# EasyEDA Pro project ProProject_飞镖发射架调试用控制板_2024-03-21.epro

# Schematic Schematic1
Create Date: 2024-01-27; Page Name: P1; Project Name: 飞镖发射架调试用控制板; Schematic Name: Schematic1; Update Date: 2024-03-21; Company: 嘉立创EDA; Page Size: A4; Version: V1.0
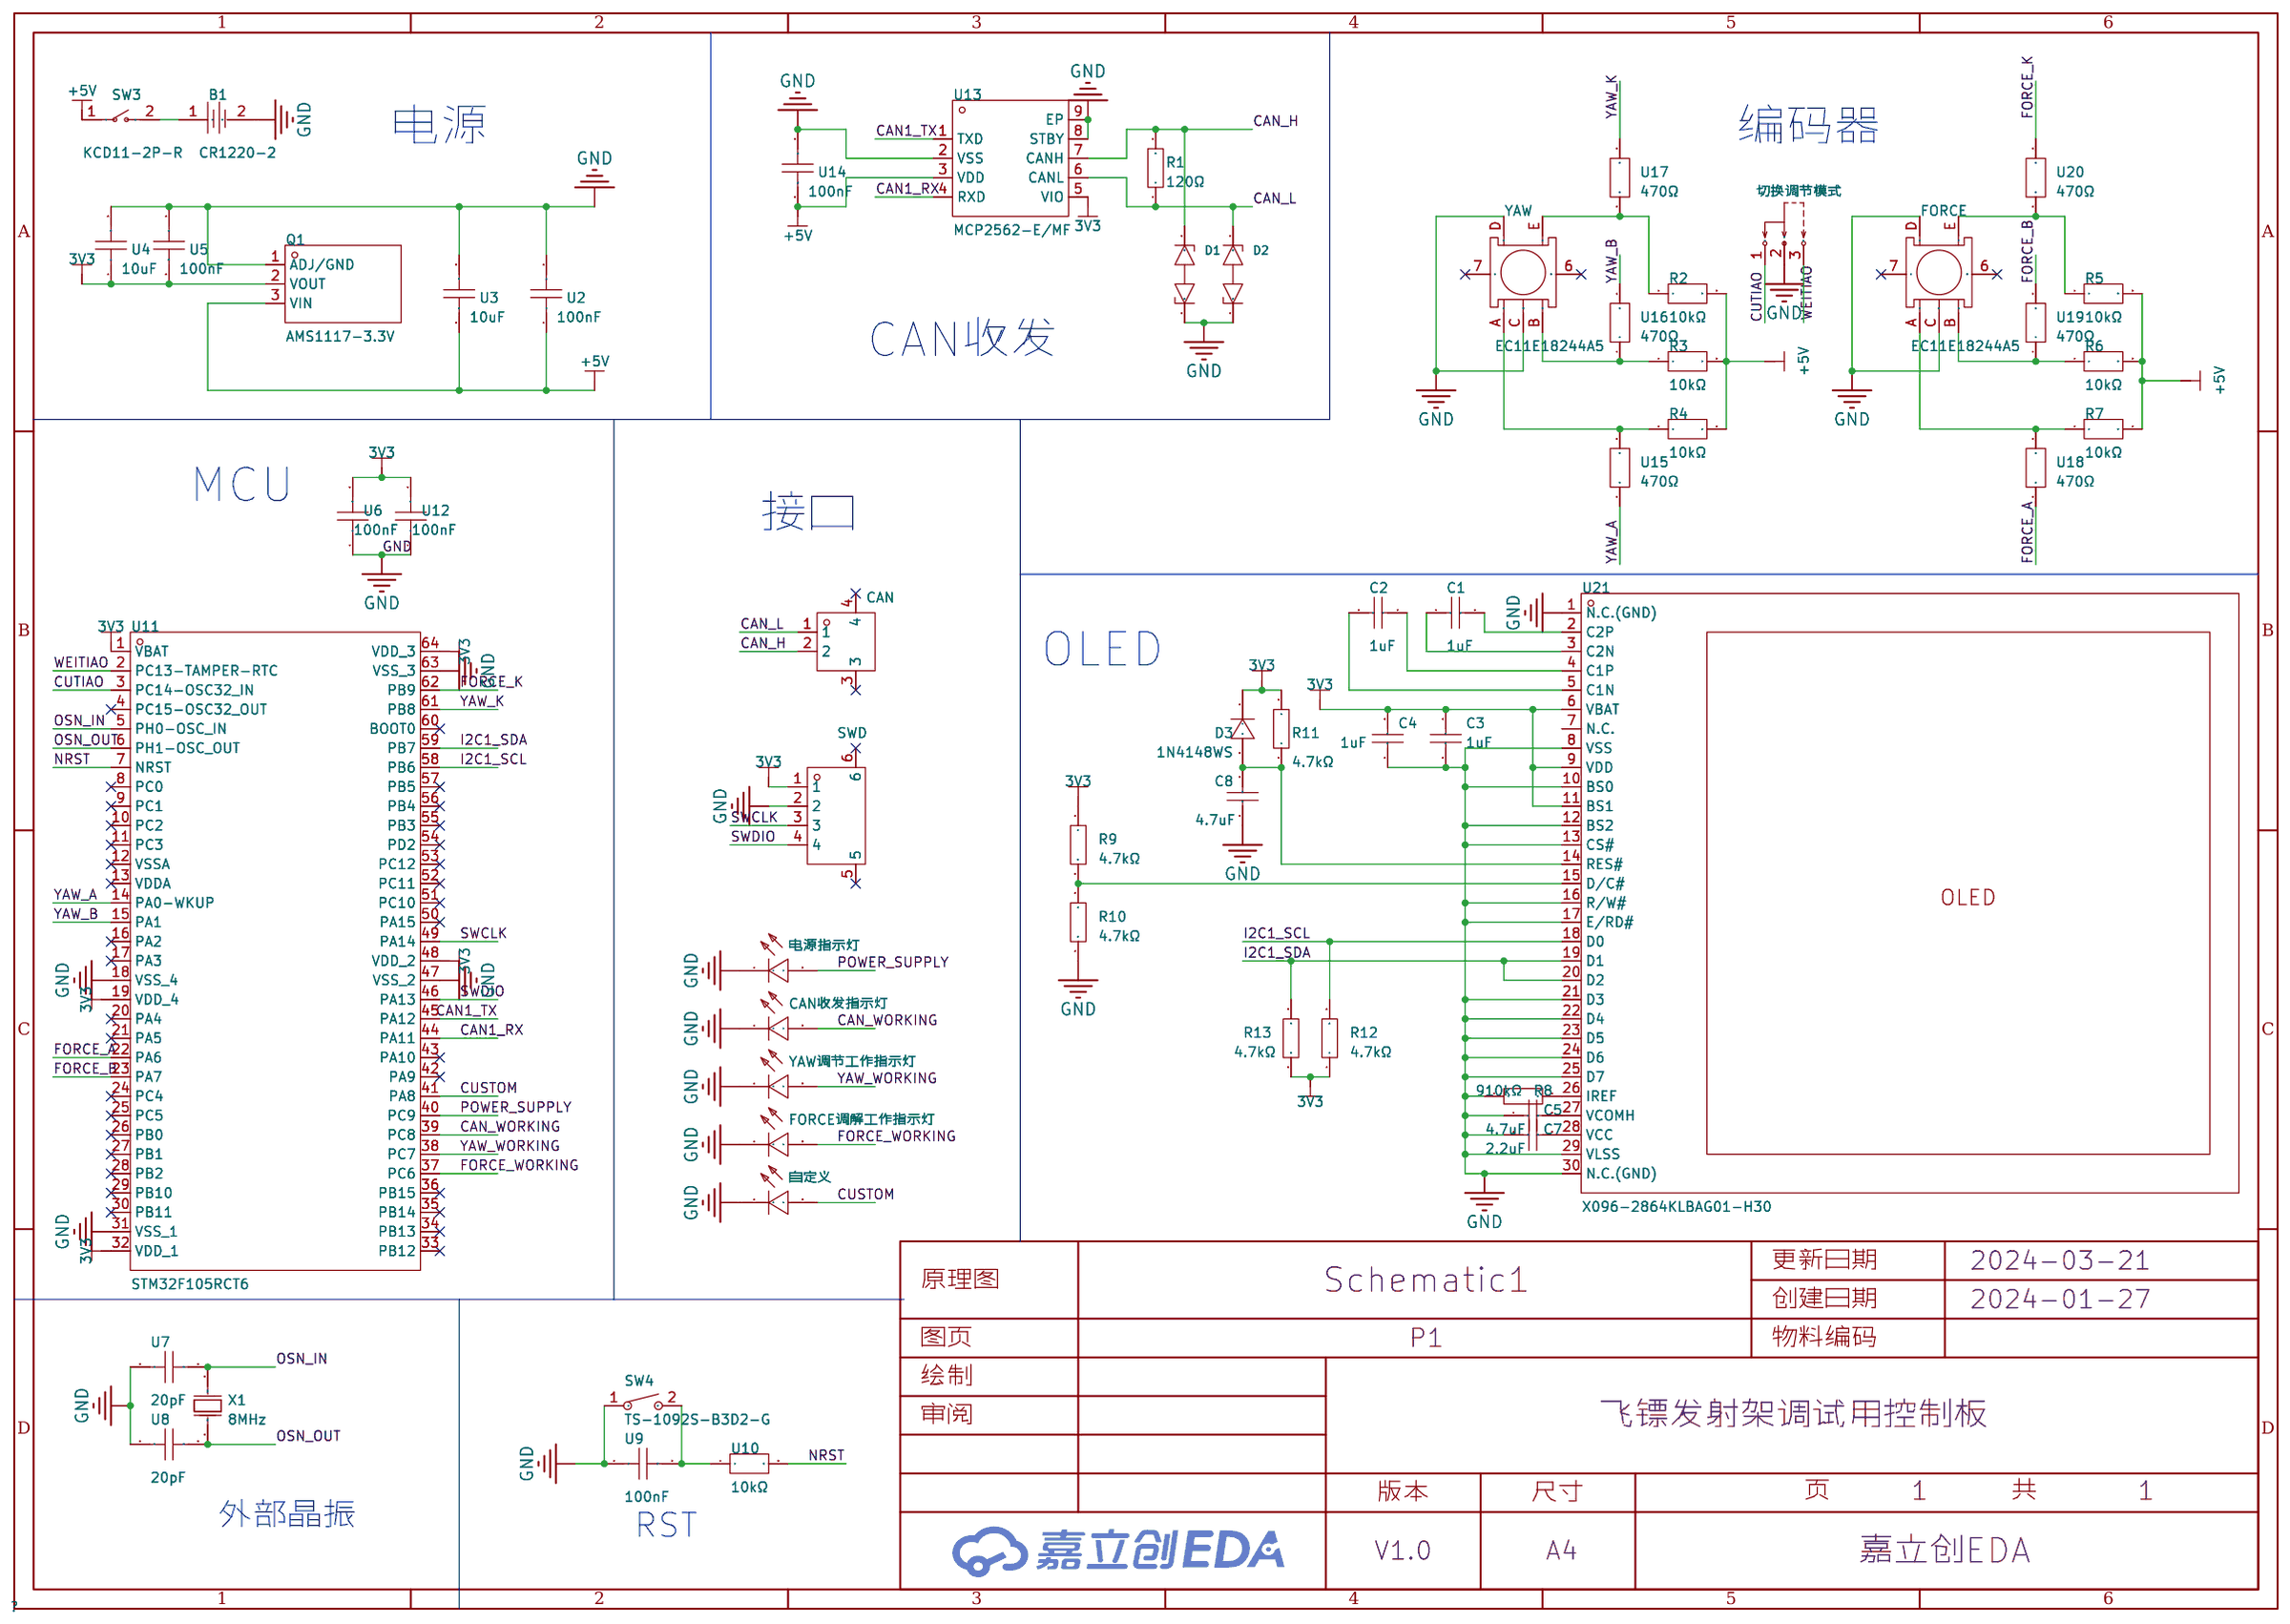
[diagram p0: schematic sheet]

## Parts
B1  CR1220-2  [BAT-SMD_CR1220-2]
C1  1uF  [C0603]
C2  1uF  [C0603]
C3  1uF  [C0603]
C4  1uF  [C0603]
C5  4.7uF  [C0603]
C7  2.2uF  [C0603]
C8  4.7uF  [C0603]
CAN  WAFER-GH1.25-2PLB  [CONN-TH_2P-P1.25_XUNPU_WAFER-GH1.25-2PLB]
CAN收发指示灯  NCD0603R1  [LED0603-RD_RED]
D1  PESD5V0S1BA,115  [SOD-323_L1.7-W1.3-LS2.5-BI]
D2  PESD5V0S1BA,115  [SOD-323_L1.7-W1.3-LS2.5-BI]
D3  1N4148WS  [SOD-323_L1.8-W1.3-LS2.5-RD]
FORCE  EC11E18244A5  [SW-TH_EC11E18244A5]
FORCE调解工作指示灯  NCD0603R1  [LED0603-RD_RED]
Q1  AMS1117-3.3V  [SOT-89-3_L4.5-W2.5-P1.50-LS4.2-BR]
R1  120Ω  [R0603]
R2  10kΩ  [R0603]
R3  10kΩ  [R0603]
R4  10kΩ  [R0603]
R5  10kΩ  [R0603]
R6  10kΩ  [R0603]
R7  10kΩ  [R0603]
R8  910kΩ  [R0603]
R9  4.7kΩ  [R0603]
R10  4.7kΩ  [R0603]
R11  4.7kΩ  [R0603]
R12  4.7kΩ  [R0603]
R13  4.7kΩ  [R0603]
SW3  KCD11-2P-R  [SW-TH_2P-L15.0-W10.5-P5.00_KCD11-2P-R]
SW4  TS-1092S-B3D2-G  [SW-SMD_L6.1-W3.6-LS7.9]
SWD  WAFER-MX1.25-4PWB  [CONN-SMD_4P-P1.25_WAFER-MX1.25-4PWB]
U2  100nF  [C0603]
U3  10uF  [C0603]
U4  10uF  [C0603]
U5  100nF  [C0603]
U6  100nF  [C0603]
U7  20pF  [C0402]
U8  20pF  [C0402]
U9  100nF  [C0603]
U10  10kΩ  [R0603]
U11  STM32F105RCT6  [LQFP-64_L10.0-W10.0-P0.50-LS12.0-BL]
U12  100nF  [C0603]
U13  MCP2562-E/MF  [DFN-8_L3.0-W3.0-P0.65-BL-EP]
U14  100nF  [C0603]
U15  470Ω  [R0603]
U16  470Ω  [R0603]
U17  470Ω  [R0603]
U18  470Ω  [R0603]
U19  470Ω  [R0603]
U20  470Ω  [R0603]
U21  X096-2864KLBAG01-H30  [OLED-SMD_X096-2864KLBAG01-H30]
X1  8MHz  [CRYSTAL-SMD_L5.0-W3.2]
YAW  EC11E18244A5  [SW-TH_EC11E18244A5]
YAW调节工作指示灯  NCD0603R1  [LED0603-RD_RED]
切换调节模式  SS12D10G5  [SW-TH_SHOU-HAN_SS12D10G4]
电源指示灯  NCD0603R1  [LED0603-RD_RED]
自定义  NCD0603R1  [LED0603-RD_RED]

## Library data of the parts
B1 = CR1220-2: 连接器类型:电池底座;适用电池规格:CR1220;工作温度范围:-;; LCSC Part Name: 电池底座 适用电池:CR1220; Supplier Part: C70381; Manufacturer: Q&J; Supplier Footprint: SMD; JLCPCB Part Class: 扩展库; Datasheet: https://atta.szlcsc.com/upload/public/pdf/source/20160427/1461725216696.pdf; Supplier: LCSC; Connector Type: 电池底座; Battery Type: CR1220
C1-C4 = 0603B105K250NT: 容值:1uF;精度:±10%;额定电压:25V;材质(温度系数):X7R;; LCSC Part Name: 1uF ±10% 25V; Supplier Part: C59302; Manufacturer: FH(风华); Supplier Footprint: 0603; JLCPCB Part Class: 扩展库; Datasheet: https://atta.szlcsc.com/upload/public/pdf/source/20200305/C486355_26A10D38EF8C2A5C37091D0039909270.pdf; Supplier: LCSC; Tolerance: ±10%; Voltage Rated: 25V; Temperature Coefficient: X7R
C5 C8 = CL10A475KO8NNNC: 容值:4.7uF;精度:±10%;额定电压:16V;材质(温度系数):X5R;; LCSC Part Name: 4.7uF ±10% 16V; Supplier Part: C19666; Manufacturer: SAMSUNG(三星); Supplier Footprint: 0603; JLCPCB Part Class: 基础库; Datasheet: https://atta.szlcsc.com/upload/public/pdf/source/20160218/1457707763339.pdf; Supplier: LCSC; Tolerance: ±10%; Voltage Rated: 16V; Temperature Coefficient: X5R
C7 = CL10A225KO8NNNC: 容值:2.2uF;精度:±10%;额定电压:16V;材质(温度系数):X5R;; LCSC Part Name: 2.2uF ±10% 16V; Supplier Part: C23630; Manufacturer: SAMSUNG(三星); Supplier Footprint: 0603; JLCPCB Part Class: 基础库; Datasheet: https://atta.szlcsc.com/upload/public/pdf/source/20160218/1457707763339.pdf; Supplier: LCSC; Tolerance: ±10%; Voltage Rated: 16V; Temperature Coefficient: X5R
CAN = WAFER-GH1.25-2PLB: 插针结构:1x2P;间距:1.25mm;安装方式:立贴;参考系列:GH;总PIN数:2P;排数:1;每排PIN数:2;额定电流:1A;工作温度范围:-25℃~+85℃;; LCSC Part Name: 1x2P 间距:1.25mm 立贴 系列:GH; Supplier Part: C3029368; Manufacturer: XUNPU(讯普); Supplier Footprint: SMD,P=1.25mm; JLCPCB Part Class: 扩展库; Datasheet: https://atta.szlcsc.com/upload/public/pdf/source/20220527/44F824AAC8C2B617205E15955FF9C23D.pdf; Supplier: LCSC; Pins Structure: 1x2P; Pitch: 1.25mm; Mounting Style: 立贴; Reference Series: GH; Number of Pins: 2P; Number of Rows: 1; Number of PINs Per Row: 2; Current Rating (Max): 1A; Operating Temperature Range: -25℃~+85℃
CAN收发指示灯 FORCE调解工作指示灯 YAW调节工作指示灯 电源指示灯 自定义 = NCD0603R1_C84263: 灯头类型:-;发光颜色:红色;正向电压(VF):1.6V~2.6V;功率:65mW;正向电流:20mA;主波长:615nm~630nm;二极管配置:独立二极管;透镜颜色:无色透明透镜;色温:-;发光强度:80mcd~220mcd;发光角度:130°;载带方式:-;工作温度:-30℃~+85℃;; Supplier Part: C84263; Manufacturer: 国星光电; Supplier Footprint: 0603; JLCPCB Part Class: 扩展库; Datasheet: https://atta.szlcsc.com/upload/public/pdf/source/20200820/C84263_DABC6A75E58F576973B407FDBA283D60.pdf; Supplier: LCSC; Emitted Color: 红色; Forward Voltage (VF): 1.6V~2.6V; Power Dissipation: 65mW; Forward Current: 20mA; Dominant Wavelength: 615nm~630nm; Diode Configuration: 独立二极管; Lens Color: 无色透明透镜; Luminous Intensity: 80mcd~220mcd; Viewing Angle: 130°; Operating Temperature: -30℃~+85℃
D1 D2 = PESD5V0S1BA,115: 极性:双向;反向截止电压(Vrwm):5V;最大钳位电压:14V;峰值脉冲电流(Ipp)@10/1000us:12A;峰值脉冲功率(Ppp)@10/1000us:130W;击穿电压:5.5V;; Supplier Part: C19224; Manufacturer: Nexperia(安世); Supplier Footprint: SOD-323; JLCPCB Part Class: 扩展库; Datasheet: https://atta.szlcsc.com/upload/public/pdf/source/20161024/1477288630856.pdf; Supplier: LCSC; polarity: 双向; Reverse Stand-Off Voltage (Vrwm): 5V; Maximum Clamping Voltage: 14V; Peak Pulse Current (Ipp)@10/1000us: 12A; Peak Pulse Power Dissipation (Ppp)@10/1000us: 130W; Breakdown Voltage: 5.5V; Type: TVS
D3 = 1N4148WS_C2128: 二极管配置:独立式;正向压降(Vf):1.25V@150mA;直流反向耐压(Vr):100V;平均整流电流(Io):150mA;功率:200mW;反向恢复时间(trr):4ns;; LCSC Part Name: 电压:100V 电流:150mA; Supplier Part: C2128; Manufacturer: CJ(江苏长电/长晶); Supplier Footprint: SOD-323; JLCPCB Part Class: 基础库; Datasheet: https://atta.szlcsc.com/upload/public/pdf/source/20140809/1457707208178.pdf; Supplier: LCSC; Diode Configuration: 独立式; Forward Voltage (Vf@If): 1.25V@150mA; Reverse Voltage (Vr): 100V; Average Rectified Current (Io): 150mA; Power Dissipation: 200mW; Reverse Leakage Current: 1uA@75V; Reverse Recovery Time (trr): 4ns
FORCE YAW = EC11E18244A5: Supplier Part: C255515; Manufacturer: ALPSALPINE(阿尔卑斯阿尔派); Supplier Footprint: 插件; JLCPCB Part Class: 扩展库; Datasheet: https://atta.szlcsc.com/upload/public/pdf/source/20180717/C255515_FDB072715C920DA9BADE9D32EFEB8093.pdf; Supplier: LCSC
Q1 = AMS1117-3.3V_C5120796: 输出类型:固定;最大输入电压:18V;输出电压:3.3V;最大输出电流:1A;输出极性:正极;; LCSC Part Name: 输入18V 输出3.3V 1A; Supplier Part: C5120796; Manufacturer: MSKSEMI(美森科); Supplier Footprint: SOT-89; JLCPCB Part Class: 扩展库; Datasheet: https://atta.szlcsc.com/upload/public/pdf/source/20231123/6117526697EB8BF6175FDEEBA0877266.pdf; Supplier: LCSC; Output Type: 固定; Maximum Input Voltage: 18V; Output Voltage: 3.3V; MAX Output Current: 1A; Dropout Voltage: 1.4V@(1A); standby current: 12mA; Operating Temperature: 0℃~+125℃; Output Polarity: 正极; Number of Outputs: 1
R1 = 0603WAF1200T5E: 电阻类型:厚膜电阻;阻值:120Ω;精度:±1%;功率:100mW;最大工作电压:75V;温度系数:±100ppm/℃;; LCSC Part Name: 120Ω ±1% 100mW 厚膜电阻; Supplier Part: C22787; Manufacturer: UNI-ROYAL(厚声); Supplier Footprint: 0603; JLCPCB Part Class: 基础库; Datasheet: https://atta.szlcsc.com/upload/public/pdf/source/20200306/C422600_1E6D84923E4A46A82E41ADD87F860B5C.pdf; Supplier: LCSC; Type: 厚膜电阻; Tolerance: ±1%; Power(Watts): 100mW; Overload Voltage (Max): 75V; Temperature Coefficient: ±100ppm/℃; Operating Temperature Range: -55℃~+155℃
R2-R7 = PLT0603Z1002LBTS: 电阻类型:薄膜电阻;阻值:10kΩ;精度:±0.01%;功率:150mW;温度系数:±5ppm/℃;; LCSC Part Name: 薄膜电阻 10kΩ ±0.01% 150mW; Supplier Part: C4120651; Manufacturer: VISHAY(威世); Supplier Footprint: 0603; JLCPCB Part Class: 扩展库; Datasheet: https://atta.szlcsc.com/upload/public/pdf/source/20231215/6F73BE5C790484D1FB16D055C429B1A5.pdf; Supplier: LCSC; Type: 薄膜电阻; Tolerance: ±0.01%; Power(Watts): 150mW; Temperature Coefficient: ±5ppm/℃; Operating Temperature Range: -55℃~+125℃
R8 = 0603WAF9103T5E: 电阻类型:厚膜电阻;阻值:910kΩ;精度:±1%;功率:100mW;最大工作电压:75V;温度系数:±100ppm/℃;; LCSC Part Name: 910kΩ ±1% 100mW 厚膜电阻; Supplier Part: C23263; Manufacturer: UNI-ROYAL(厚声); Supplier Footprint: 0603; JLCPCB Part Class: 扩展库; Datasheet: https://atta.szlcsc.com/upload/public/pdf/source/20200306/C422600_1E6D84923E4A46A82E41ADD87F860B5C.pdf; Supplier: LCSC; Type: 厚膜电阻; Tolerance: ±1%; Power(Watts): 100mW; Overload Voltage (Max): 75V; Temperature Coefficient: ±100ppm/℃; Operating Temperature Range: -55℃~+155℃
R9-R13 = 0603WAF4701T5E: 电阻类型:厚膜电阻;阻值:4.7kΩ;精度:±1%;功率:100mW;最大工作电压:75V;温度系数:±100ppm/℃;; LCSC Part Name: 4.7kΩ ±1% 100mW 厚膜电阻; Supplier Part: C23162; Manufacturer: UNI-ROYAL(厚声); Supplier Footprint: 0603; JLCPCB Part Class: 基础库; Datasheet: https://atta.szlcsc.com/upload/public/pdf/source/20200306/C422600_1E6D84923E4A46A82E41ADD87F860B5C.pdf; Supplier: LCSC; Type: 厚膜电阻; Tolerance: ±1%; Power(Watts): 100mW; Overload Voltage (Max): 75V; Temperature Coefficient: ±100ppm/℃; Operating Temperature Range: -55℃~+155℃
SW3 = KCD11-2P-R: 带灯:无;引脚样式:焊片;额定电流:3A;额定电压(AC):250V;额定电压(DC):-;电路结构:单刀单掷;机械寿命:1万次;; LCSC Part Name: 10.5*15mm 两脚两档跷板开关 红钮; Supplier Part: C5884414; Manufacturer: SHOU HAN(首韩); Supplier Footprint: 插件; JLCPCB Part Class: 扩展库; Datasheet: https://atta.szlcsc.com/upload/public/pdf/source/20230506/CD06DFDE35C8048D34175BFF4AF6A2C2.pdf; Supplier: LCSC; Switch Length: 15mm; Switch Width: 10.5mm; Switch Height: 17.2mm; Actuator Type: 凹面弯曲; With Lamp: 无; Pin Style: 焊片; Actuator Color: 红色; Contact Current: 3A; Voltage Rating (AC): 250V; Circuit: 单刀单掷; Mechanical Life: 1万次; Operating Temperature: 0℃~+125℃; Actuator Identifier: - O
SW4 = TS-1092S-B3D2-G: 电路结构:单刀单掷;按钮形状:矩形按钮;作用力:250gf;安装方式:立贴;开关长度:6.1mm;开关宽度:3.6mm;开关高度:2.5mm;带支架:不带;机械寿命:-;; LCSC Part Name: 6.1*3.6*2.5mm 立贴 轻触开关; Supplier Part: C520860; Manufacturer: Yuandi(元迪); Supplier Footprint: SMD; JLCPCB Part Class: 扩展库; Datasheet: https://atta.szlcsc.com/upload/public/pdf/source/20200424/C520860_DA5AE47D9A9DC527FC720B5FF0895739.pdf; Supplier: LCSC; Circuit: 单刀单掷; Actuator Style: 矩形按钮; Operating Force: 250gf; Mounting Style: 立贴; Switch Length: 6.1mm; Switch Width: 3.6mm; Switch Height: 2.5mm; Strike Gundam: 不带; Actuator/Cap Color: 灰色; Pin Style: 鸥翼型
SWD = WAFER-MX1.25-4PWB: 插针结构:1x4P;间距:1.25mm;安装方式:卧贴;总PIN数:4P;排数:1;每排PIN数:4;额定电流:1A;工作温度范围:-25℃~+85℃;; LCSC Part Name: 1x4P 间距:1.25mm 卧贴; Supplier Part: C3029361; Manufacturer: XUNPU(讯普); Supplier Footprint: SMD,P=1.25mm,卧贴; JLCPCB Part Class: 扩展库; Datasheet: https://atta.szlcsc.com/upload/public/pdf/source/20220527/5ACBB683E384B6AD06743F272F933620.pdf; Supplier: LCSC; Pins Structure: 1x4P; Pitch: 1.25mm; Mounting Style: 卧贴; Number of Pins: 4P; Number of Rows: 1; Number of PINs Per Row: 4; Current Rating (Max): 1A; Operating Temperature Range: -25℃~+85℃
U2 U5 U6 U9 U12 U14 = EMK107B7104MA-T: 容值:100nF;精度:±20%;额定电压:16V;材质(温度系数):X7R;; LCSC Part Name: 100nF ±20% 16V; Supplier Part: C2185815; Manufacturer: TAIYO YUDEN(太诱); Supplier Footprint: 0603; JLCPCB Part Class: 扩展库; Datasheet: https://atta.szlcsc.com/upload/public/pdf/source/20210525/C2802164_C0429B055888A674C3F00BA74B841C5B.pdf; Supplier: LCSC; Tolerance: ±20%; Voltage Rated: 16V; Temperature Coefficient: X7R
U3 U4 = GRM188R60J106ME84D: 容值:10uF;精度:±20%;额定电压:6.3V;材质(温度系数):X5R;; LCSC Part Name: 10uF ±20% 6.3V; Supplier Part: C192094; Manufacturer: muRata(村田); Supplier Footprint: 0603; JLCPCB Part Class: 扩展库; Datasheet: https://atta.szlcsc.com/upload/public/pdf/source/20230811/DDC3561B4B66AF01DA7F36766FE64666.pdf; Supplier: LCSC; Tolerance: ±20%; Voltage Rated: 6.3V; Temperature Coefficient: X5R
U7 U8 = 0402YA200JAT2A: 容值:20pF;精度:±5%;额定电压:16V;材质(温度系数):C0G;; LCSC Part Name: 20pF ±5% 16V; Supplier Part: C2174546; Manufacturer: Kyocera AVX; Supplier Footprint: 0402; JLCPCB Part Class: 扩展库; Datasheet: https://atta.szlcsc.com/upload/public/pdf/source/20210531/846B6B99683E5FCB44502B03188C284A.pdf; Supplier: LCSC; Tolerance: ±5%; Voltage Rated: 16V; Temperature Coefficient: C0G
U10 = APC0603T10K0Z: 电阻类型:薄膜电阻;阻值:10kΩ;精度:±0.01%;功率:63mW;温度系数:±5ppm/℃;; LCSC Part Name: 薄膜电阻 10kΩ ±0.01% 63mW; Supplier Part: C6125857; Manufacturer: Ohmite; Supplier Footprint: 0603; Supplier: LCSC; Type: 薄膜电阻; Tolerance: ±0.01%; Power(Watts): 63mW; Temperature Coefficient: ±5ppm/℃; Operating Temperature Range: -55℃~+155℃
U11 = STM32F105RCT6: CPU内核:CM3;程序存储容量:256KB;RAM总容量:64KB;GPIO端口数量:51;工作电压范围:2V~3.6V;CPU最大主频:72MHz;程序存储器类型:FLASH;; Supplier Part: C8345; Manufacturer: ST(意法半导体); Supplier Footprint: LQFP-64(10x10); JLCPCB Part Class: 扩展库; Datasheet: https://atta.szlcsc.com/upload/public/pdf/source/20140724/1457707161919.pdf; Supplier: LCSC; CPU Core: CM3; Program Storage Size: 256KB; RAM Size: 64KB; GPIO Ports Number: 51; Operating Voltage Range: 2V~3.6V; CPU Maximum Speed: 72MHz; Program Memory Type: FLASH; Operating Temperature Range: -40℃~+85℃; ADC (Bit): 12bit; DAC (Bit): 12bit; Universal Serial Bus: 有; Peripheral/Function: DMA；看门狗；看门狗; Watchdog: 有; Infrared Data Association: 有; Low-Voltage Detect: 有; Direct Memory Access: 有; Internal Oscillator: 有
U13 = MCP2562-E/MF: 类型:收发器;; Supplier Part: C635113; Manufacturer: MICROCHIP(美国微芯); Supplier Footprint: DFN-8-EP(3x3); JLCPCB Part Class: 扩展库; Datasheet: https://atta.szlcsc.com/upload/public/pdf/source/20150713/1457707330677.pdf; Supplier: LCSC; Type: 收发器; Supply Voltage: 4.5V~5.5V; Operating Temperature: -40℃~+125℃
U15-U20 = SC0603J4700F2BNRH: 阻值:470Ω;精度:±5%;功率:-;温度系数:±100ppm/℃;; LCSC Part Name: 470Ω ±5%; Supplier Part: C3152165; Manufacturer: Sunway(信维通信); Supplier Footprint: 0603; JLCPCB Part Class: 扩展库; Datasheet: https://atta.szlcsc.com/upload/public/pdf/source/20220728/FFCE43BB6DF8FA16AEE331F0F4B289DE.pdf; Supplier: LCSC; Tolerance: ±5%; Temperature Coefficient: ±100ppm/℃
U21 = X096-2864KLBAG01-H30: 主控芯片:SSD1315;尺寸(inch):0.96;像素分辨率:128x64;; LCSC Part Name: 0.96寸 蓝光 128x64像素分辨率 30PIN; Supplier Part: C4944144; Manufacturer: Newvision(新智景); Datasheet: https://atta.szlcsc.com/upload/public/pdf/source/20220811/AFF42A01440844B6AF7EF5D26E15DF13.pdf; Supplier: LCSC; Main Control Chip: SSD1315; Size: 0.96; Pixel Resolution: 128x64; Operating Temperature: -40℃~+85℃
X1 = X50328MSB2GI: 晶振类型:贴片晶振;频率:8MHz;常温频差:±10ppm;外接负载电容:20pF;频率稳定度(全温):±50ppm;; LCSC Part Name: 8MHz ±10ppm 20pF YSX530GA; Supplier Part: C115962; Manufacturer: YXC(扬兴晶振); Supplier Footprint: SMD5032; JLCPCB Part Class: 基础库; Datasheet: https://atta.szlcsc.com/upload/public/pdf/source/20230220/0EBFFB9D6D8CE6A211407822BBB6C516.pdf; Supplier: LCSC; Crystal Type: 贴片晶振; Normal temperature Frequency Tolerance: ±10ppm; External load capacitor: 20pF; Frequency Stability(Full temperature range): ±50ppm; Operating Temperature: -40℃~+85℃
切换调节模式 = SS12D10G5: 电路结构:单刀双掷;安装方式:直插;额定电流(DC):2A;额定电压(DC):125V;机械寿命:3千次;; LCSC Part Name: 两档立式插件 3脚拨动开关 柄长5.0mm; Supplier Part: C7431054; Manufacturer: SHOU HAN(首韩); Supplier Footprint: 插件; JLCPCB Part Class: 扩展库; Datasheet: https://atta.szlcsc.com/upload/public/pdf/source/20231130/7A3DB6A149BF0A1DCFFE64FFC07FE434.pdf; Supplier: LCSC; Circuit: 单刀双掷; Switch Length: 12.7mm; Switch Width: 6.7mm; Mounting Style: 直插; Current Rating (DC): 2A; Voltage Rating (DC): 125V; Mechanical Life: 3千次; Operating Temperature: -25℃~+70℃

## Nets
3V3: C3.2 C4.2 D3.1(K) Q1.2(VOUT) R9.1 R11.2 R12.1 R13.1 SWD.1 U4.1 U5.2 U6.2 U11.1(VBAT) U11.19(VDD_4) U11.32(VDD_1) U11.48(VDD_2) U11.64(VDD_3) U12.2 U13.5(VIO) U21.6(VBAT) U21.9(VDD) U21.11(BS1)
+5V: Q1.3(VIN) R2.2 R3.2 R4.2 R5.2 R6.2 R7.2 SW3.1 U2.1 U3.1 U13.3(VDD) U14.1
GND: B1.2 C3.1 C4.1 C5.1 C7.1 C8.1 CAN收发指示灯.1(K) D1.1 D2.1 FORCE.C FORCE.D FORCE调解工作指示灯.1(K) Q1.1(ADJ/GND) R8.1 R10.1 SW4.1 SWD.2 U2.2 U3.2 U4.2 U5.1 U6.1 U7.1 U8.1 U9.1 U11.18(VSS_4) U11.31(VSS_1) U11.47(VSS_2) U11.63(VSS_3) U12.1 U13.2(VSS) U13.8(STBY) U13.9(EP) U14.2 U21.1(N.C.(GND)) U21.8(VSS) U21.10(BS0) U21.12(BS2) U21.13(CS#) U21.16(R/W#) U21.17(E/RD#) U21.21(D3) U21.22(D4) U21.23(D5) U21.24(D6) U21.25(D7) U21.29(VLSS) U21.30(N.C.(GND)) YAW.C YAW.D YAW调节工作指示灯.1(K) 切换调节模式.2 电源指示灯.1(K) 自定义.1(K)
CAN1_RX: U11.44(PA11) U13.4(RXD)
CAN1_TX: U11.45(PA12) U13.1(TXD)
CAN_H: CAN.2 D1.2 R1.2 U13.7(CANH)
CAN_L: CAN.1 D2.2 R1.1 U13.6(CANL)
CAN_WORKING: CAN收发指示灯.2(A) U11.39(PC8)
CUSTOM: U11.41(PA8) 自定义.2(A)
CUTIAO: U11.3(PC14-OSC32_IN) 切换调节模式.1
FORCE_A: U11.22(PA6) U18.1
FORCE_B: U11.23(PA7) U19.2
FORCE_K: U11.62(PB9) U20.2
FORCE_WORKING: FORCE调解工作指示灯.2(A) U11.37(PC6)
I2C1_SCL: R12.2 U11.58(PB6) U21.18(D0)
I2C1_SDA: R13.2 U11.59(PB7) U21.19(D1) U21.20(D2)
NRST: U10.2 U11.7(NRST)
OSN_IN: U7.2 U11.5(PH0-OSC_IN) X1.2(OSC2)
OSN_OUT: U8.2 U11.6(PH1-OSC_OUT) X1.1(OSC1)
POWER_SUPPLY: U11.40(PC9) 电源指示灯.2(A)
SWCLK: SWD.3 U11.49(PA14)
SWDIO: SWD.4 U11.46(PA13)
WEITIAO: U11.2(PC13-TAMPER-RTC) 切换调节模式.3
YAW_A: U11.14(PA0-WKUP) U15.1
YAW_B: U11.15(PA1) U16.2
YAW_K: U11.61(PB8) U17.2
YAW_WORKING: U11.38(PC7) YAW调节工作指示灯.2(A)
$1N1277: B1.1 SW3.2
$1N3182: SW4.2 U9.2 U10.1
$1N6633: R4.1 U15.2 YAW.A
$1N6650: R3.1 U16.1 YAW.B
$1N6654: R2.1 U17.1 YAW.E
$1N7258: FORCE.A R7.1 U18.2
$1N7262: FORCE.B R6.1 U19.1
$1N7266: FORCE.E R5.1 U20.1
$1N9830: C1.2 U21.2(C2P)
$1N9834: C1.1 U21.3(C2N)
$1N9838: C2.2 U21.4(C1P)
$1N9842: C2.1 U21.5(C1N)
$1N10917: R9.2 R10.2 U21.15(D/C#)
$1N10983: C8.2 D3.2(A) R11.1 U21.14(RES#)
$1N15207: R8.2 U21.26(IREF)
$1N15209: C5.2 U21.27(VCOMH)
$1N15211: C7.2 U21.28(VCC)

Not connected (* = marked no-connect by the designer): CAN 3* 4*; FORCE 6* 7*; SWD 5* 6*; U11 4(PC15-OSC32_OUT)* 8(PC0)* 9(PC1)* 10(PC2)* 11(PC3)* 12(VSSA)* 13(VDDA)* 16(PA2)* 17(PA3)* 20(PA4)* 21(PA5)* 24(PC4)* 25(PC5)* 26(PB0)* 27(PB1)* 28(PB2)* 29(PB10)* 30(PB11)* 33(PB12)* 34(PB13)* 35(PB14)* 36(PB15)* 42(PA9)* 43(PA10)* 50(PA15)* 51(PC10)* 52(PC11)* 53(PC12)* 54(PD2)* 55(PB3)* 56(PB4)* 57(PB5)* 60(BOOT0)*; U21 7(N.C.); YAW 6* 7*

## Notes on the sheet
- 电源
- 编码器
- CAN收发
- MCU
- 接口
- OLED
- 外部晶振
- RST

# Board PCB1
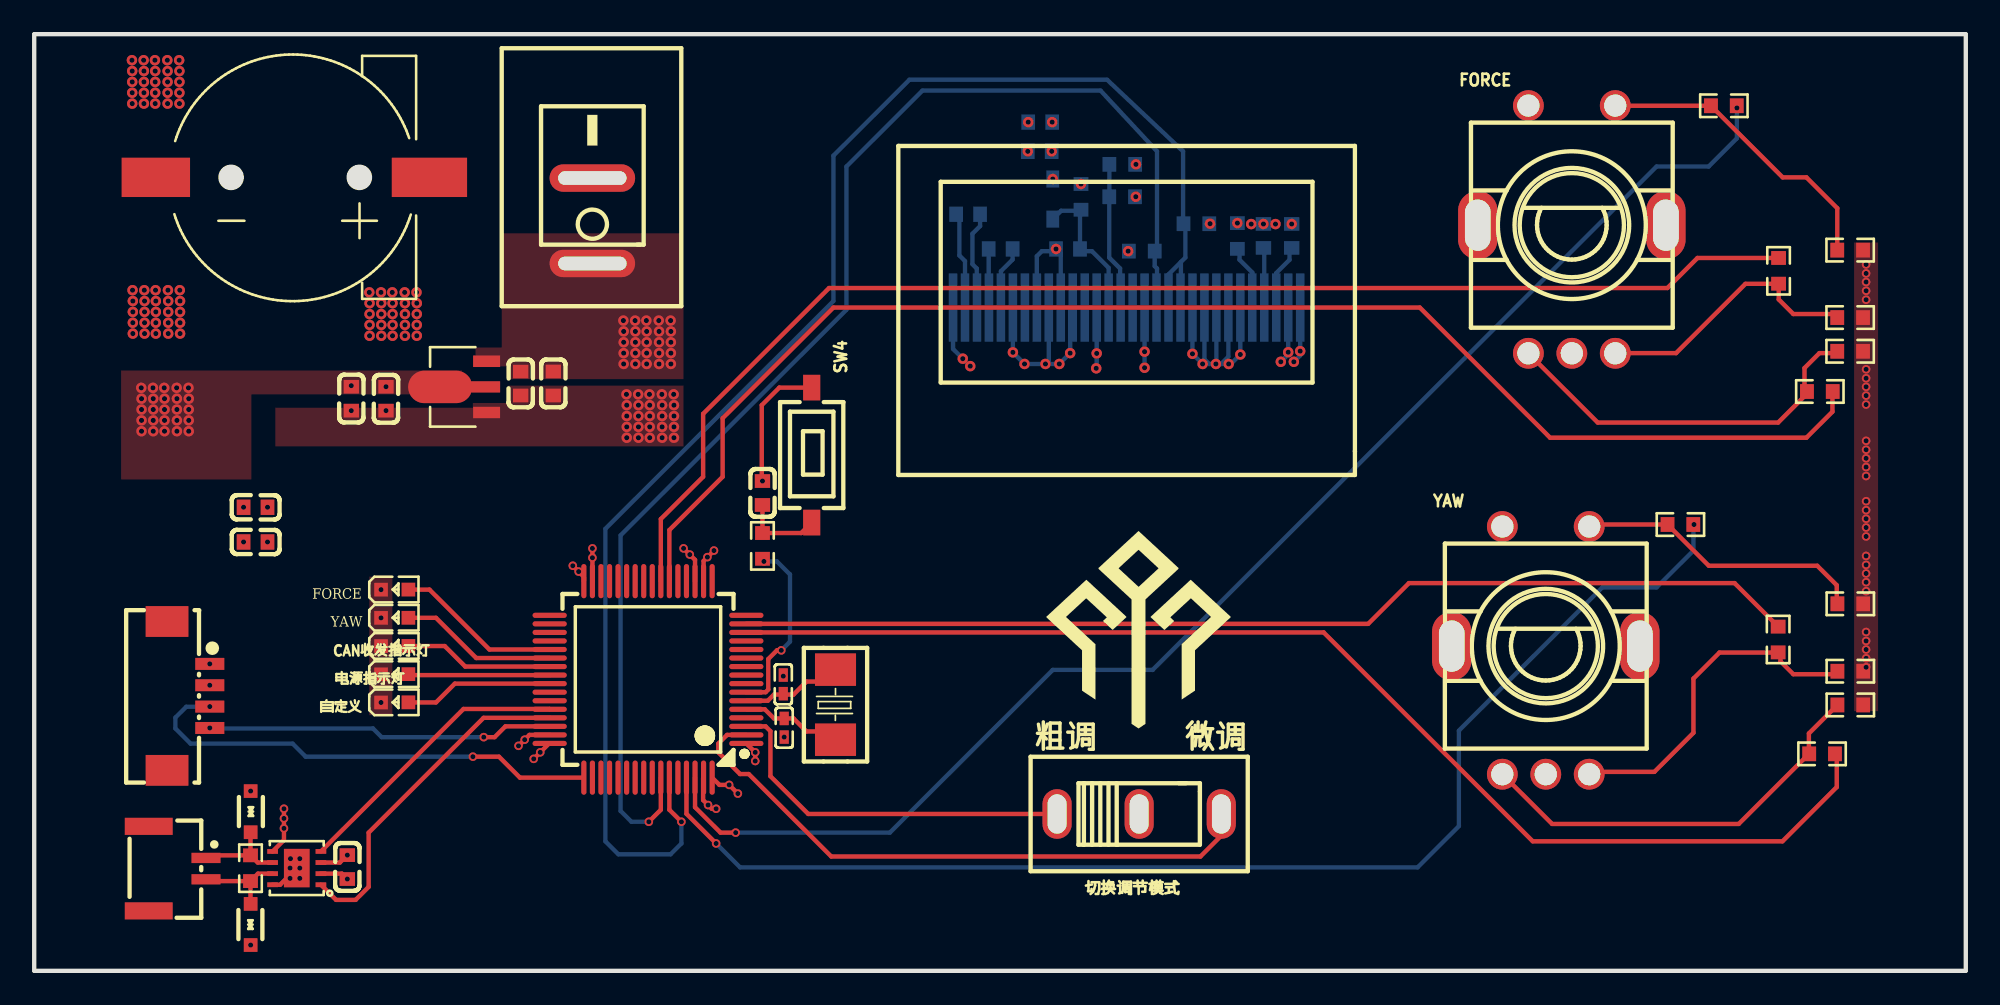
[diagram p1: board, top side]
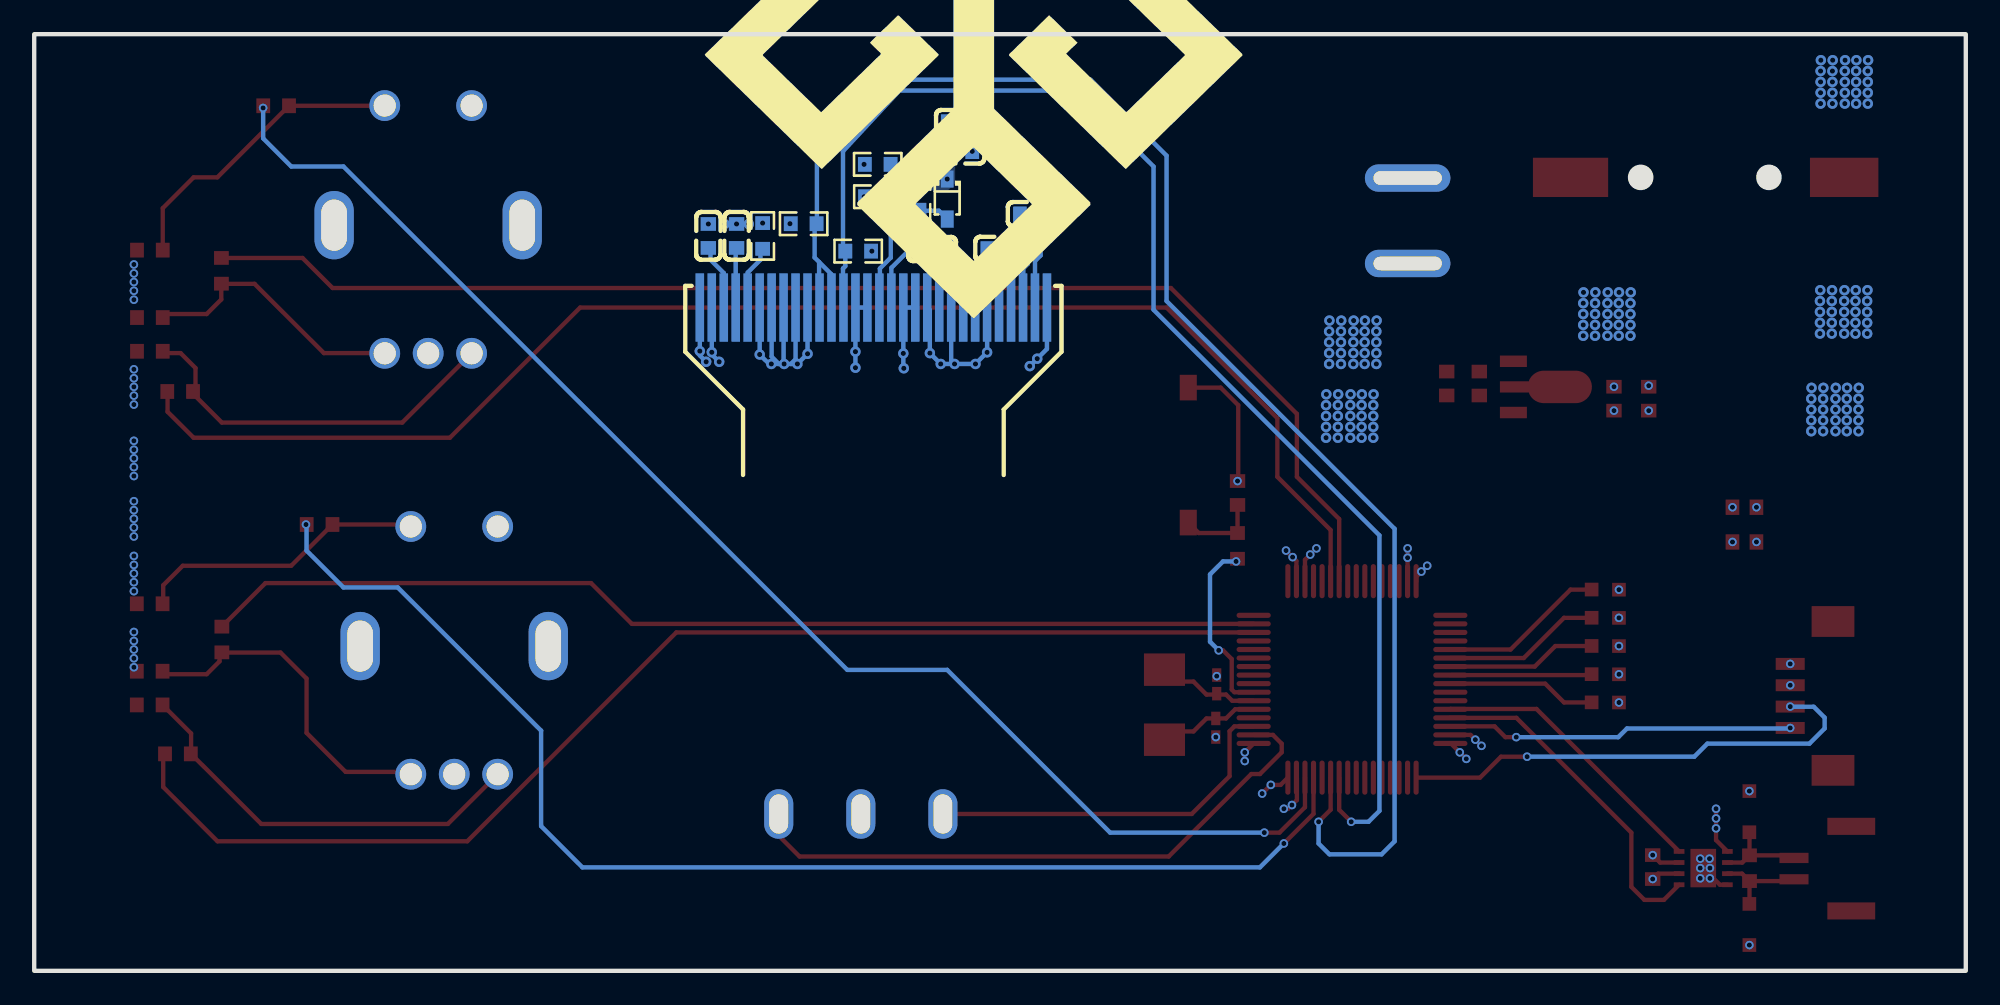
[diagram p2: board, bottom side, seen from below]

Outline 112.95 x 54.83 mm; copper layers: Top Layer, Inner1, Inner2, Bottom Layer. Coordinates in mm from the lower left corner of the outline.
Outline path: rectangle 0,54.83 112.95,0
Stack: Top Layer 0.035mm 外层铜厚1oz / Dielectric1 0.2104mm 7628 RC49% 8.6mil / Inner1 0.0152mm 内层铜厚 / Dielectric2 1.065mm 1.1mm H/HOZ 含铜 / Inner2 0.0152mm 内层铜厚 / Dielectric3 0.2104mm 7628 RC49% 8.6mil / Bottom Layer 0.035mm 外层铜厚1oz

## Design rules (mm)
template: JLCPCB Capability(Two Layers Board)
spacing copperThickness1oz (default): track to track 0.102, other pairs 0.152 to 0.3
spacing copperThickness2oz: track to track 0.203, other pairs 0.152 to 0.3
track width copperThickness1oz (default): min 0.127, default 0.254, max 2.54
track width copperThickness2oz: min 0.203, default 0.254, max 2.54
differential pair differentialPair (default): width min 0.127, default 0.254, max 2.54; gap min 0.152, default 0.152
via viaSize (default): diameter min 0.5, default 0.61, max 10; hole min 0.3, default 0.305, max 6.3

## Placement (name value [footprint] x y rotation side)
B1  CR1220-2  [BAT-SMD_CR1220-2]  15.11 46.44 180 top
C1  1uF  [C0603]  54.61 44.29 180 bottom
C2  1uF  [C0603]  56.52 42.25 180 bottom
C3  1uF  [C0603]  58.83 49.68 0 bottom
C4  1uF  [C0603]  58.8 47.97 0 bottom
C5  4.7uF  [C0603]  71.88 43.02 270 bottom
C7  2.2uF  [C0603]  73.53 43.02 270 bottom
C8  4.7uF  [C0603]  60.46 42.25 0 bottom
CAN  WAFER-GH1.25-2PLB  [CONN-TH_2P-P1.25_XUNPU_WAFER-GH1.25-2PLB]  8.37 5.98 270 top
CAN收发指示灯  NCD0603R1  [LED0603-RD_RED]  21.08 19.01 0 top
D1  PESD5V0S1BA,115  [SOD-323_L1.7-W1.3-LS2.5-BI]  12.66 2.71 90 top
D2  PESD5V0S1BA,115  [SOD-323_L1.7-W1.3-LS2.5-BI]  12.66 9.32 270 top
D3  1N4148WS  [SOD-323_L1.8-W1.3-LS2.5-RD]  59.56 45.17 270 bottom
FORCE  EC11E18244A5  [SW-TH_EC11E18244A5]  89.92 43.4 0 top
FORCE#2  -  [LED0603-RD_RED]  21.08 22.31 0 top
Q1  AMS1117-3.3V  [SOT-89-3_L4.5-W2.5-P1.50-LS4.2-BR]  25.1 34.18 0 top
R1  120Ω  [R0603]  12.65 6.01 270 top
R2  10kΩ  [R0603]  106.2 21.48 0 top
R3  10kΩ  [R0603]  106.2 17.54 0 top
R4  10kΩ  [R0603]  106.2 15.56 0 top
R5  10kΩ  [R0603]  106.19 42.19 0 top
R6  10kΩ  [R0603]  106.19 38.24 0 top
R7  10kΩ  [R0603]  106.19 36.26 0 top
R8  910kΩ  [R0603]  70.36 43.02 270 bottom
R9  4.7kΩ  [R0603]  63.63 47.21 180 bottom
R10  4.7kΩ  [R0603]  63.62 45.31 180 bottom
R11  4.7kΩ  [R0603]  61.21 45.3 90 bottom
R12  4.7kΩ  [R0603]  64.77 42.13 0 bottom
R13  4.7kΩ  [R0603]  67.96 43.73 180 bottom
SW3  KCD11-2P-R  [SW-TH_2P-L15.0-W10.5-P5.00_KCD11-2P-R]  32.64 43.9 90 top
SW4  TS-1092S-B3D2-G  [SW-SMD_L6.1-W3.6-LS7.9]  45.47 30.19 270 top
SWD  WAFER-MX1.25-4PWB  [CONN-SMD_4P-P1.25_WAFER-MX1.25-4PWB]  9.02 16.09 270 top
U2  100nF  [C0603]  30.35 34.38 270 top
U3  10uF  [C0603]  28.45 34.38 270 top
U4  10uF  [C0603]  18.54 33.49 270 top
U5  100nF  [C0603]  20.57 33.49 90 top
U6  100nF  [C0603]  12.94 25.1 180 top
U7  20pF  [C0402]  43.86 14.23 90 top
U8  20pF  [C0402]  43.8 16.77 270 top
U9  100nF  [C0603]  42.59 27.97 270 top
U10  10kΩ  [R0603]  42.59 24.87 270 top
U11  STM32F105RCT6  [LQFP-64_L10.0-W10.0-P0.50-LS12.0-BL]  35.89 17.06 90 top
U12  100nF  [C0603]  12.94 27.14 180 top
U13  MCP2562-E/MF  [DFN-8_L3.0-W3.0-P0.65-BL-EP]  15.35 6.01 90 top
U14  100nF  [C0603]  18.31 6.07 270 top
U15  470Ω  [R0603]  104.55 12.7 180 top
U16  470Ω  [R0603]  101.98 19.39 90 top
U17  470Ω  [R0603]  96.27 26.12 0 top
U18  470Ω  [R0603]  104.42 33.91 180 top
U19  470Ω  [R0603]  102.01 40.97 90 top
U20  470Ω  [R0603]  98.81 50.64 0 top
U21  X096-2864KLBAG01-H30  [OLED-SMD_X096-2864KLBAG01-H30]  63.88 38.82 0 top
X1  8MHz  [CRYSTAL-SMD_L5.0-W3.2]  46.86 15.58 270 top
YAW  EC11E18244A5  [SW-TH_EC11E18244A5]  88.39 18.76 0 top
YAW#2  -  [LED0603-RD_RED]  21.08 20.66 0 top
切换调节模式  SS12D10G5  [SW-TH_SHOU-HAN_SS12D10G4]  64.62 9.18 0 top
电源指示灯  NCD0603R1  [LED0603-RD_RED]  21.08 17.36 0 top
自定义  NCD0603R1  [LED0603-RD_RED]  21.08 15.71 0 top

## Footprints (pads in the part's own frame, mm; a bottom-side part is the same pattern mirrored in y, then rotated)
BAT-SMD_CR1220-2
  rect 4.4x2.3 smd: 1(-8,0)
  rect 4x2.3 smd: 2(8,0)
C0402
  rect 0.79x0.54 smd: 1(-0.545,0) 2(0.545,0)
C0603
  rect 0.8x0.9 smd: 1(-0.7,0) 2(0.7,0)
CONN-SMD_4P-P1.25_WAFER-MX1.25-4PWB
  rect 0.7x1.7 smd: 1(-1.875,1.25) 2(-0.625,1.25) 3(0.625,1.25) 4(1.875,1.25)
  rect 1.8x2.5 smd: 5(4.355,-1.25) 6(-4.355,-1.25)
CONN-TH_2P-P1.25_XUNPU_WAFER-GH1.25-2PLB
  rect 0.6x1.7 smd: 1(-0.625,1.675) 2(0.625,1.675)
  rect 1x2.8 smd: 3(2.475,-1.675) 4(-2.475,-1.675)
CRYSTAL-SMD_L5.0-W3.2
  rect 1.9x2.4 smd: 1(-2.05,0) 2(2.05,0)
DFN-8_L3.0-W3.0-P0.65-BL-EP
  rect 0.28x0.625 smd: 1(-0.975,-1.413) 2(-0.325,-1.413) 3(0.325,-1.413) 4(0.975,-1.413) 5(0.975,1.413) 6(0.325,1.413) 7(-0.325,1.413) 8(-0.975,1.413)
  rect 2.25x1.5 smd: 9(0,0)
LED0603-RD_RED
  rect 0.8x0.8 smd: 1(-0.799,-0.004) 2(0.799,0.004)
LQFP-64_L10.0-W10.0-P0.50-LS12.0-BL
  oval 0.3x2 smd: 1(-3.75,-5.75) 2(-3.25,-5.75) 3(-2.75,-5.75) 4(-2.25,-5.75) 5(-1.75,-5.75) 6(-1.25,-5.75) 7(-0.75,-5.75) 8(-0.25,-5.75) 9(0.25,-5.75) 10(0.75,-5.75) 11(1.25,-5.75) 12(1.75,-5.75) 13(2.25,-5.75) 14(2.75,-5.75) 15(3.25,-5.75) 16(3.75,-5.75) 33(3.75,5.75) 34(3.25,5.75) 35(2.75,5.75) 36(2.25,5.75) 37(1.75,5.75) 38(1.25,5.75) 39(0.75,5.75) 40(0.25,5.75) 41(-0.25,5.75) 42(-0.75,5.75) 43(-1.25,5.75) 44(-1.75,5.75) 45(-2.25,5.75) 46(-2.75,5.75) 47(-3.25,5.75) 48(-3.75,5.75)
  oval 2x0.3 smd: 17(5.75,-3.75) 18(5.75,-3.25) 19(5.75,-2.75) 20(5.75,-2.25) 21(5.75,-1.75) 22(5.75,-1.25) 23(5.75,-0.75) 24(5.75,-0.25) 25(5.75,0.25) 26(5.75,0.75) 27(5.75,1.25) 28(5.75,1.75) 29(5.75,2.25) 30(5.75,2.75) 31(5.75,3.25) 32(5.75,3.75) 49(-5.75,3.75) 50(-5.75,3.25) 51(-5.75,2.75) 52(-5.75,2.25) 53(-5.75,1.75) 54(-5.75,1.25) 55(-5.75,0.75) 56(-5.75,0.25) 57(-5.75,-0.25) 58(-5.75,-0.75) 59(-5.75,-1.25) 60(-5.75,-1.75) 61(-5.75,-2.25) 62(-5.75,-2.75) 63(-5.75,-3.25) 64(-5.75,-3.75)
OLED-SMD_X096-2864KLBAG01-H30
  rect 0.5x4 smd far side: 1(-10.15,0) 2(-9.45,0) 3(-8.75,0) 4(-8.05,0) 5(-7.35,0) 6(-6.65,0) 7(-5.95,0) 8(-5.25,0) 9(-4.55,0) 10(-3.85,0) 11(-3.15,0) 12(-2.45,0) 13(-1.75,0) 14(-1.05,0) 15(-0.35,0) 16(0.35,0) 17(1.05,0) 18(1.75,0) 19(2.45,0) 20(3.15,0) 21(3.85,0) 22(4.55,0) 23(5.25,0) 24(5.95,0) 25(6.65,0) 26(7.35,0) 27(8.05,0) 28(8.75,0) 29(9.45,0) 30(10.15,0)
R0603
  rect 0.806x0.864 smd: 1(-0.753,0) 2(0.753,0)
SOD-323_L1.7-W1.3-LS2.5-BI
  rect 0.8x0.8 smd: 1(-1.205,0) 2(1.205,0)
SOD-323_L1.8-W1.3-LS2.5-RD
  rect 1x0.75 smd: 1(-1.173,0) 2(1.173,0)
SOT-89-3_L4.5-W2.5-P1.50-LS4.2-BR
  rect 1.575x0.672 smd: 1(1.356,-1.5) 3(1.356,1.5)
  custom 5.377x1.9 smd: 2(-1.356,0)
SW-SMD_L6.1-W3.6-LS7.9
  rect 1.5x1 smd: 1(-3.95,0) 2(3.95,0)
SW-TH_2P-L15.0-W10.5-P5.00_KCD11-2P-R
  oval 1.6x5 hole 0.8x4: 1(-2.5,0) 2(2.5,0)
SW-TH_EC11E18244A5
  oval 2.3x4 hole 1.5x3: 6(5.5,0.25) 7(-5.5,0.25)
  round 1.8 hole 1.3: A(-2.54,-7.25) B(2.54,-7.25) C(0,-7.25) D(-2.54,7.25) E(2.54,7.25)
SW-TH_SHOU-HAN_SS12D10G4
  oval 1.7x2.9 hole 1.1x2.3: 1(-4.8,0) 2(0,0) 3(4.8,0)

## Nets
As in the schematic, except:
GND: B1.2 C3.1 C4.1 C5.1 C7.1 C8.1 CAN收发指示灯.1 D1.1 D2.1 FORCE.C FORCE.D FORCE#2.1 Q1.1 R8.1 R10.1 SW4.1 SWD.2 U2.2 U3.2 U4.2 U5.1 U6.1 U7.1 U8.1 U9.1 U11.18 U11.31 U11.47 U11.63 U12.1 U13.2 U13.8 U13.9 U14.2 U21.1 U21.8 U21.10 U21.12 U21.13 U21.16 U21.17 U21.21 U21.22 U21.23 U21.24 U21.25 U21.29 U21.30 YAW.C YAW.D YAW#2.1 切换调节模式.2 电源指示灯.1 自定义.1
FORCE_WORKING: FORCE#2.2 U11.37
YAW_WORKING: U11.38 YAW#2.2

Pads without a net: CAN 3 4; FORCE 6 7; SWD 5 6; U11 4 8 9 10 11 12 13 16 17 20 21 24 25 26 27 28 29 30 33 34 35 36 42 43 50 51 52 53 54 55 56 57 60; U21 7; YAW 6 7

## Via types
v1: diameter 0.61, hole 0.305, Top Layer to Bottom Layer, 186 vias
v2: diameter 0.5, hole 0.3, Top Layer to Bottom Layer, 91 vias

## Routing (per net, layer and track width the routed paths; a pad name or vN(x,y) marks a point on that pad's centre or on a via; arc(x,y) is an arc through that point)
3V3: length 23.1
  Top Layer w0.254: v2(41.15,10.38) v2(40.64,10.88) 40.07,10.88 U11.64 ; 42.16,12.41 v2(42.16,12.79) U11.1 ; v2(37.97,24.73) v2(38.34,24.36) 38.64,24.06 U11.19 ; U13.5 14.61,7.65 v2(14.61,8.34) v2(14.61,8.92) v2(14.61,9.49) ; U11.32 32.14,23.06 v2(31.84,23.37) v2(31.5,23.71) ; v2(29.21,12.41) v2(29.59,12.79) 30.11,13.31 U11.48
  Bottom Layer w0.254: U21.11 60.58,38.67 v1(60.58,36.16) v1(59.94,35.52) v1(59.13,35.52) ; U21.6 v1(57.23,36.2) v1(57.91,35.52) v1(59.13,35.52) ; U21.9 59.33,35.72 v1(59.13,35.52)
  vias: v1(6.26,34.12) v1(6.28,33.49) v1(6.28,32.86) v1(6.28,32.22) v1(6.28,31.59) v1(6.94,34.12) v1(6.96,33.49) v1(6.96,32.86) v1(6.96,32.22) v1(6.96,31.59) v1(7.6,34.12) v1(7.62,33.49) v1(7.62,32.86) v1(7.62,32.22) v1(7.62,31.59) v1(8.33,34.12) v1(8.34,33.49) v1(8.34,32.86) v1(8.34,32.22) v1(8.34,31.59) v1(9.02,34.12) v1(9.04,33.49) v1(9.04,32.86) v1(9.04,32.22) v1(9.04,31.59) v1(59.53,49.68) v1(59.5,47.97) v1(59.56,46.35) v1(61.21,46.05) v1(63.97,42.13) v1(64.43,47.21) v1(68.76,43.73) v2(10.27,17.97) v2(12.24,27.14) v2(12.24,25.1) v2(18.54,34.25) v2(20.57,34.19) v2(42.16,12.28)
+5V: length 1.7
  Top Layer w0.254: U13.3 17.88,6.34 v2(18.31,6.77)
  vias: v1(34.45,38.06) v1(34.47,37.43) v1(34.47,36.79) v1(34.47,36.16) v1(34.47,35.52) v1(35.14,38.06) v1(35.16,37.43) v1(35.16,36.79) v1(35.16,36.16) v1(35.16,35.52) v1(35.8,38.06) v1(35.81,37.43) v1(35.81,36.79) v1(35.81,36.16) v1(35.81,35.52) v1(36.52,38.06) v1(36.54,37.43) v1(36.54,36.79) v1(36.54,36.16) v1(36.54,35.52) v1(37.21,38.06) v1(37.23,37.43) v1(37.23,36.79) v1(37.23,36.16) v1(37.23,35.52) v2(107.12,41.35) v2(107.12,40.82) v2(107.12,40.32) v2(107.12,39.81) v2(107.12,39.28) v2(107.12,35.21) v2(107.12,34.69) v2(107.12,34.18) v2(107.12,33.67) v2(107.12,33.15) v2(107.12,31.03) v2(107.12,30.5) v2(107.12,30) v2(107.12,29.49) v2(107.12,28.96) v2(107.12,27.49) v2(107.12,26.96) v2(107.12,26.46) v2(107.12,25.95) v2(107.12,25.42) v2(107.12,24.29) v2(107.12,23.76) v2(107.12,23.26) v2(107.12,22.75) v2(107.12,22.22) v2(107.12,19.83) v2(107.12,19.31) v2(107.12,18.81) v2(107.12,18.29) v2(107.12,17.77)
GND: length 65.5
  Top Layer w0.254: v2(39.75,24.6) v2(39.37,24.22) 39.14,23.99 U11.18 ; v2(39.88,9.49) 39.62,9.49 v2(39.41,9.7) 39.12,10 39.12,11.28 U11.63 ; U11.31 v2(32.64,24.18) v2(32.64,24.73) ; v2(42.59,28.67) 42.55,28.71 42.55,33.11 43.57,34.14 SW4.1 ; U13.2 18,5.69 v2(18.31,5.37) ; U11.47 28.96,13.81 v2(28.68,13.53) v2(28.32,13.17) ; U13.8 14.38,5.04 U13.9
  Bottom Layer w0.254: v1(72.9,35.65) 73.33,36.08 v1(73.33,36.21) U21.29 ; v1(73.66,35.65) 74.03,36.02 v1(74.03,36.27) U21.30 ; 69.4,35.52 69.98,35.52 v1(70.53,36.08) U21.25 ; 69.4,35.52 69.83,35.95 U21.24 ; 69.4,35.52 v1(69.1,35.52) ; U21.23 69.13,35.55 v1(69.1,35.52) ; 68.71,35.52 v1(69.1,35.52) ; 68.71,35.52 68.43,35.8 U21.22 ; 68.71,35.52 v1(68.33,35.52) v1(67.73,36.12) U21.21 ; 62.13,35.27 v1(62.13,36.14) U21.13 U21.12 ; U21.1 53.73,36.4 v1(54.3,35.83) v1(54.74,35.4) ; U21.10 60.03,41.98 v1(59.75,42.25) 59.63,42.13 58.93,42.13 58.63,41.83 U21.8 ; U21.16 U21.17 v1(64.93,36.24) v1(64.93,35.3) 64.9,35.27
  vias: v1(5.72,53.3) v1(5.73,52.67) v1(5.73,52.03) v1(5.73,51.4) v1(5.73,50.76) v1(5.75,39.84) v1(5.77,39.21) v1(5.77,38.57) v1(5.77,37.94) v1(5.77,37.3) v1(6.4,53.3) v1(6.42,52.67) v1(6.42,52.03) v1(6.42,51.4) v1(6.42,50.76) v1(6.44,39.84) v1(6.45,39.21) v1(6.45,38.57) v1(6.45,37.94) v1(6.45,37.3) v1(7.06,53.3) v1(7.08,52.67) v1(7.08,52.03) v1(7.08,51.4) v1(7.08,50.76) v1(7.1,39.84) v1(7.11,39.21) v1(7.11,38.57) v1(7.11,37.94) v1(7.11,37.3) v1(7.78,53.3) v1(7.8,52.67) v1(7.8,52.03) v1(7.8,51.4) v1(7.8,50.76) v1(7.82,39.84) v1(7.84,39.21) v1(7.84,38.57) v1(7.84,37.94) v1(7.84,37.3) v1(8.48,53.3) v1(8.49,52.67) v1(8.49,52.03) v1(8.49,51.4) v1(8.49,50.76) v1(8.51,39.84) v1(8.53,39.21) v1(8.53,38.57) v1(8.53,37.94) v1(8.53,37.3) v1(19.59,39.71) v1(19.61,39.08) v1(19.61,38.44) v1(19.61,37.81) v1(19.61,37.17) v1(20.28,39.71) v1(20.3,39.08) v1(20.3,38.44) v1(20.3,37.81) v1(20.3,37.17) v1(20.94,39.71) v1(20.95,39.08) v1(20.95,38.44) v1(20.95,37.81) v1(20.95,37.17) v1(21.66,39.71) v1(21.68,39.08) v1(21.68,38.44) v1(21.68,37.81) v1(21.68,37.17) v1(22.36,39.71) v1(22.37,39.08) v1(22.37,38.44) v1(22.37,37.81) v1(22.37,37.17) v1(34.63,33.74) v1(34.65,33.11) v1(34.65,32.47) v1(34.65,31.84) v1(34.65,31.2) v1(35.32,33.74) v1(35.33,33.11) v1(35.33,32.47) v1(35.33,31.84) v1(35.33,31.2) v1(35.98,33.74) v1(35.99,33.11) v1(35.99,32.47) v1(35.99,31.84) v1(35.99,31.2) v1(36.7,33.74) v1(36.72,33.11) v1(36.72,32.47) v1(36.72,31.84) v1(36.72,31.2) v1(37.39,33.74) v1(37.41,33.11) v1(37.41,32.47) v1(37.41,31.84) v1(37.41,31.2) v1(58.13,49.68) v1(58.1,47.97) v1(62.1,35.27) v1(64.42,45.31) v1(69.85,35.52) v1(70.36,43.77) v1(71.17,43.71) v1(71.88,43.72) v1(72.59,43.71) v1(73.53,43.72) v2(10.27,16.72) v2(12.66,10.52) v2(12.66,1.51) v2(13.64,27.14) v2(13.64,25.1) v2(14.99,6.57) v2(14.96,6.01) v2(14.96,5.41) v2(15.53,6.57) v2(15.53,6.01) v2(15.53,5.41) v2(18.54,32.79) v2(20.28,22.31) v2(20.28,20.66) v2(20.28,19.01) v2(20.28,17.36) v2(20.28,15.71) v2(20.57,32.79) v2(43.8,17.25) v2(43.86,13.68)
CAN1_RX: length 16.8
  Top Layer w0.254: U11.44 30.12,15.33 25.11,15.33 U13.4
CAN1_TX: length 20
  Top Layer w0.254: U13.1 17.65,4.15 18.8,4.15 19.56,4.92 19.56,8.09 26.28,14.81 U11.45
CAN_H: length 5.5
  Top Layer w0.254: D1.2 12.65,3.93 R1.2 ; R1.2 10.15,5.25 CAN.2 ; R1.2 13.08,5.69 U13.7
CAN_L: length 5.5
  Top Layer w0.254: CAN.1 10.2,6.76 R1.1 ; D2.2 12.65,8.1 R1.1 ; R1.1 13.07,6.34 U13.6
CAN_WORKING: length 8.8
  Top Layer w0.254: U11.39 25.21,17.81 24,19.01 21.89,19.01 CAN收发指示灯.2
CUSTOM: length 8.7
  Top Layer w0.254: 自定义.2 21.89,15.71 23.5,15.71 24.59,16.81 U11.41
CUTIAO: length 21.8
  Top Layer w0.254: 切换调节模式.1 45.26,9.18 43.05,11.39 43.05,14.03 42.77,14.31 U11.3
FORCE_A: length 83.4
  Top Layer w0.254: 105.17,33.91 105.16,33.89 105.16,32.73 103.63,31.2 88.65,31.2 81.03,38.82 46.74,38.82 40.26,32.35 40.26,28.92 37.14,25.8 U11.22
FORCE_B: length 77.5
  Top Layer w0.254: U19.2 97.26,41.73 95.5,39.97 46.48,39.97 39.12,32.6 39.12,28.92 36.64,26.45 U11.23
FORCE_K: length 81.9
  Top Layer w0.254: v2(41.02,8.09) 40.13,8.09 38.64,9.58 U11.62
  Bottom Layer w0.254: v2(99.57,50.51) 99.57,48.73 97.92,47.08 94.87,47.08 65.41,17.62 59.56,17.62 50.04,8.09 v2(41.02,8.09)
FORCE_WORKING: length 9.7
  Top Layer w0.254: U11.37 26.62,18.81 23.11,22.31 21.89,22.31 FORCE#2.2
I2C1_SCL: length 78.8
  Top Layer w0.254: U11.58 36.64,9.43 v2(35.94,8.73)
  Bottom Layer w0.254: v2(35.94,8.73) 34.93,8.73 34.29,9.36 34.29,25.49 47.5,38.7 47.5,47.08 51.94,51.52 62.36,51.52 65.66,47.97 65.66,42.26 R12.2 65.52,41.25 65.66,41.11 65.66,38.85 U21.18
I2C1_SDA: length 90.9
  Top Layer w0.254: v2(37.85,8.73) 37.14,9.43 U11.59
  Bottom Layer w0.254: 67.06,41.49 66.33,40.77 U21.19 ; 67.06,41.49 67.32,41.75 67.32,43.6 ; 67.06,41.49 67.06,38.85 U21.20 ; v2(37.85,8.73) 37.85,7.46 37.21,6.82 34.16,6.82 33.4,7.58 33.4,25.87 46.74,39.21 46.74,47.71 51.18,52.16 62.74,52.16 67.18,47.97 67.18,43.75 R13.2
NRST: length 10.6
  Top Layer w0.254: U11.7 42.77,16.31 42.93,16.47 42.93,18.25 43.43,18.76 v2(43.69,18.76)
  Bottom Layer w0.254: v2(43.69,18.76) 44.2,19.27 44.2,23.2 43.43,23.97 v2(42.67,23.97)
OSN_IN: length 6
  Top Layer w0.254: X1.2 46.38,14.01 45.16,14.01 44.4,14.77 U7.2 43.26,14.77 42.72,15.31 U11.5
OSN_OUT: length 6
  Top Layer w0.254: 43.75,16.17 U8.2 ; 43.75,16.17 43.26,16.17 42.9,15.81 U11.6 ; 43.75,16.17 44.4,16.17 45.16,16.93 46.16,16.93 X1.1
POWER_SUPPLY: length 8.3
  Top Layer w0.254: 电源指示灯.2 21.94,17.31 U11.40
SWCLK: length 28
  Top Layer w0.254: v2(25.65,12.54) 27.18,12.54 28.4,11.31 U11.49
  Bottom Layer w0.254: v2(25.65,12.54) 15.88,12.54 15.11,13.3 9.14,13.3 8.25,14.19 8.25,14.82 8.89,15.46 10.26,15.46 v2(10.27,15.47)
SWDIO: length 20.3
  Top Layer w0.254: U11.46 27.56,14.31 26.92,13.68 v2(26.29,13.68)
  Bottom Layer w0.254: 10.29,14.19 19.81,14.19 20.32,13.68 v2(26.29,13.68)
  vias: v2(10.27,14.22)
WEITIAO: length 36.1
  Top Layer w0.254: U11.2 40.52,13.81 40,13.3 40,12.79 41.28,11.52 41.78,11.52 46.61,6.69 68.2,6.69 69.42,7.91 69.42,9.18
YAW_A: length 72.1
  Top Layer w0.254: U15.1 105.41,12.59 105.41,10.76 102.24,7.58 87.63,7.58 75.4,19.81 U11.14
YAW_B: length 62.4
  Top Layer w0.254: U11.15 78,20.31 80.39,22.7 99.43,22.7 U16.2
YAW_K: length 74.8
  Top Layer w0.254: U11.61 38.14,9.19 v2(39.88,7.46)
  Bottom Layer w0.254: v2(39.88,7.46) 41.28,6.06 80.9,6.06 83.31,8.47 83.31,14.06 91.69,22.44 94.87,22.44 97.03,24.6 97.03,26.12
  vias: v2(97.06,26.12)
YAW_WORKING: length 9.2
  Top Layer w0.254: YAW#2.2 21.89,20.66 23.5,20.66 25.85,18.31 U11.38
$1N3182: length 4.8
  Top Layer w0.254: SW4.2 44.85,25.62 U10.1 U9.2
$1N6633: length 24.4
  Top Layer w0.254: R4.1 103.78,13.9 103.78,12.7 99.68,8.6 88.76,8.6 YAW.A
$1N6650: length 20.2
  Top Layer w0.254: YAW.B 91.07,11.65 94.74,11.65 97.03,13.93 97.03,17.11 98.55,18.63 102.12,18.63 102.12,18.11 102.87,17.36 105.27,17.36 R3.1
$1N6654: length 17.1
  Top Layer w0.254: YAW.E 91.05,26.12 U17.1 97.93,23.71 104.27,23.71 105.41,22.57 105.41,21.52 R2.1
$1N7258: length 22.4
  Top Layer w0.254: FORCE.A 91.43,32.09 101.98,32.09 103.52,33.63 103.52,35.28 104.39,36.16 105.33,36.16 R7.1
$1N7262: length 16
  Top Layer w0.254: FORCE.B 92.47,36.16 96.01,36.16 100.07,40.21 102.01,40.21 102.01,39.3 102.87,38.44 105.23,38.44 R6.1
$1N7266: length 17.9
  Top Layer w0.254: FORCE.E 92.47,50.64 U20.1 102.24,46.44 103.63,46.44 105.44,44.64 R5.1
$1N9830: length 5.7
  Bottom Layer w0.254: C1.2 54.1,44.1 54.1,41.87 54.43,41.54 U21.2
$1N9834: length 5.8
  Bottom Layer w0.254: U21.3 55.12,38.84 55.12,41.11 54.86,41.36 54.86,43.14 55.31,43.59 C1.1
$1N9838: length 3.4
  Bottom Layer w0.254: U21.4 55.81,38.84 C2.2
$1N9842: length 3.7
  Bottom Layer w0.254: U21.5 56.53,40.95 57.22,41.64 C2.1
$1N10917: length 8.7
  Bottom Layer w0.254: R9.2 62.87,45.32 62.86,45.31 62.86,41.75 63.5,41.11 63.5,38.86 U21.15
$1N10983: length 8.6
  Bottom Layer w0.254: 61.16,44.49 C8.2 61.28,42.13 61.85,42.13 62.83,41.14 U21.14 ; 61.16,44.49 R11.1 ; 61.16,44.49 60.05,44.49 D3.2
$1N15207: length 3.8
  Bottom Layer w0.254: R8.2 70.49,42.13 70.49,41.62 71.23,40.87 U21.26
$1N15209: length 3.5
  Bottom Layer w0.254: U21.27 71.93,42.27 C5.2
$1N15211: length 3.9
  Bottom Layer w0.254: C7.2 73.41,42.19 73.41,41.62 72.63,40.84 U21.28

## Copper pours and planes (outline as drawn; the poured copper is in the pictures)
3V3 on Top Layer: 5.08,35.14 25.02,35.14 25.02,28.76 5.08,28.76
3V3 on Bottom Layer: 59.1,50.15 61.59,50.15 61.59,45.68 59.1,45.68
3V3 on Inner1: 76.96,53.68 27.66,53.68 27.34,54 25.49,52.16 25.49,36.51 24.25,35.27 6.98,35.27 5.38,33.66 5.38,11.22 7.37,9.23 13.08,9.23 13.97,8.34 22.35,8.34 24.64,6.06 48.95,6.06 52.07,9.18 52.07,21.54 43.36,30.25 33.21,30.25 31.62,31.84 31.62,37.81 33.53,39.71 48.77,39.71 55.75,32.73 75.31,32.73 78.1,35.52 78.1,52.54
+5V on Top Layer: 25.8,43.17 37.97,43.17 37.97,34.63 25.8,34.63
+5V on Top Layer: 106.43,42.63 107.82,42.63 107.82,15.2 106.43,15.2
+5V on Inner1: 33.78,38.57 45.72,38.57 53.59,30.7 82.68,30.7 82.68,54.13 108.2,54.13 108.2,4.03 61.09,4.03 57.53,0.47 20.7,0.47 19.3,1.87 19.3,6.17 17.81,6.17 17.61,6.37 17.61,7.39 20.51,7.39 22.1,5.8 22.1,2.5 53.85,2.5 57.02,5.68 57.02,21.81 44.07,34.76 33.78,34.76
GND on Top Layer: 14.35,54.06 4.57,54.06 4.57,36.54 23.15,36.54 23.15,42.76 14.35,42.76
GND on Top Layer: -9.52,58.13 118.36,58.13 118.36,-4.86 -9.52,-4.86
GND on Top Layer: 14.1,34.25 37.97,34.25 37.97,30.7 14.1,30.7
GND on Top Layer: 19.59,23.07 20.94,23.07 20.94,14.96 19.59,14.96
GND on Inner2: 0.26,54.57 112.7,54.57 112.7,0.26 0.26,0.26
$1N1277 on Top Layer: 15.62,53.94 37.84,53.94 37.84,43.61 15.62,43.61

Small or netless copper shapes (teardrops, artwork), in the pictures only: 20 on Inner2

## Text on the board
Top Silkscreen Layer: 粗调 | 微调
